# Altium schematic sheet EDU_High-Speed-Design_CPU_SD-Card.SchDoc: CPU SD-Card
size 279 x 215 mm; Date: not used; ApprovedBy: not used; CheckedBy: not used; Author: not used; DrawnBy: not used; Organization: not used; Address4: not used; SheetNumber: 15; SheetTotal: 27; Time: not used; ImagePath: not used; Application_BuildNumber: not used
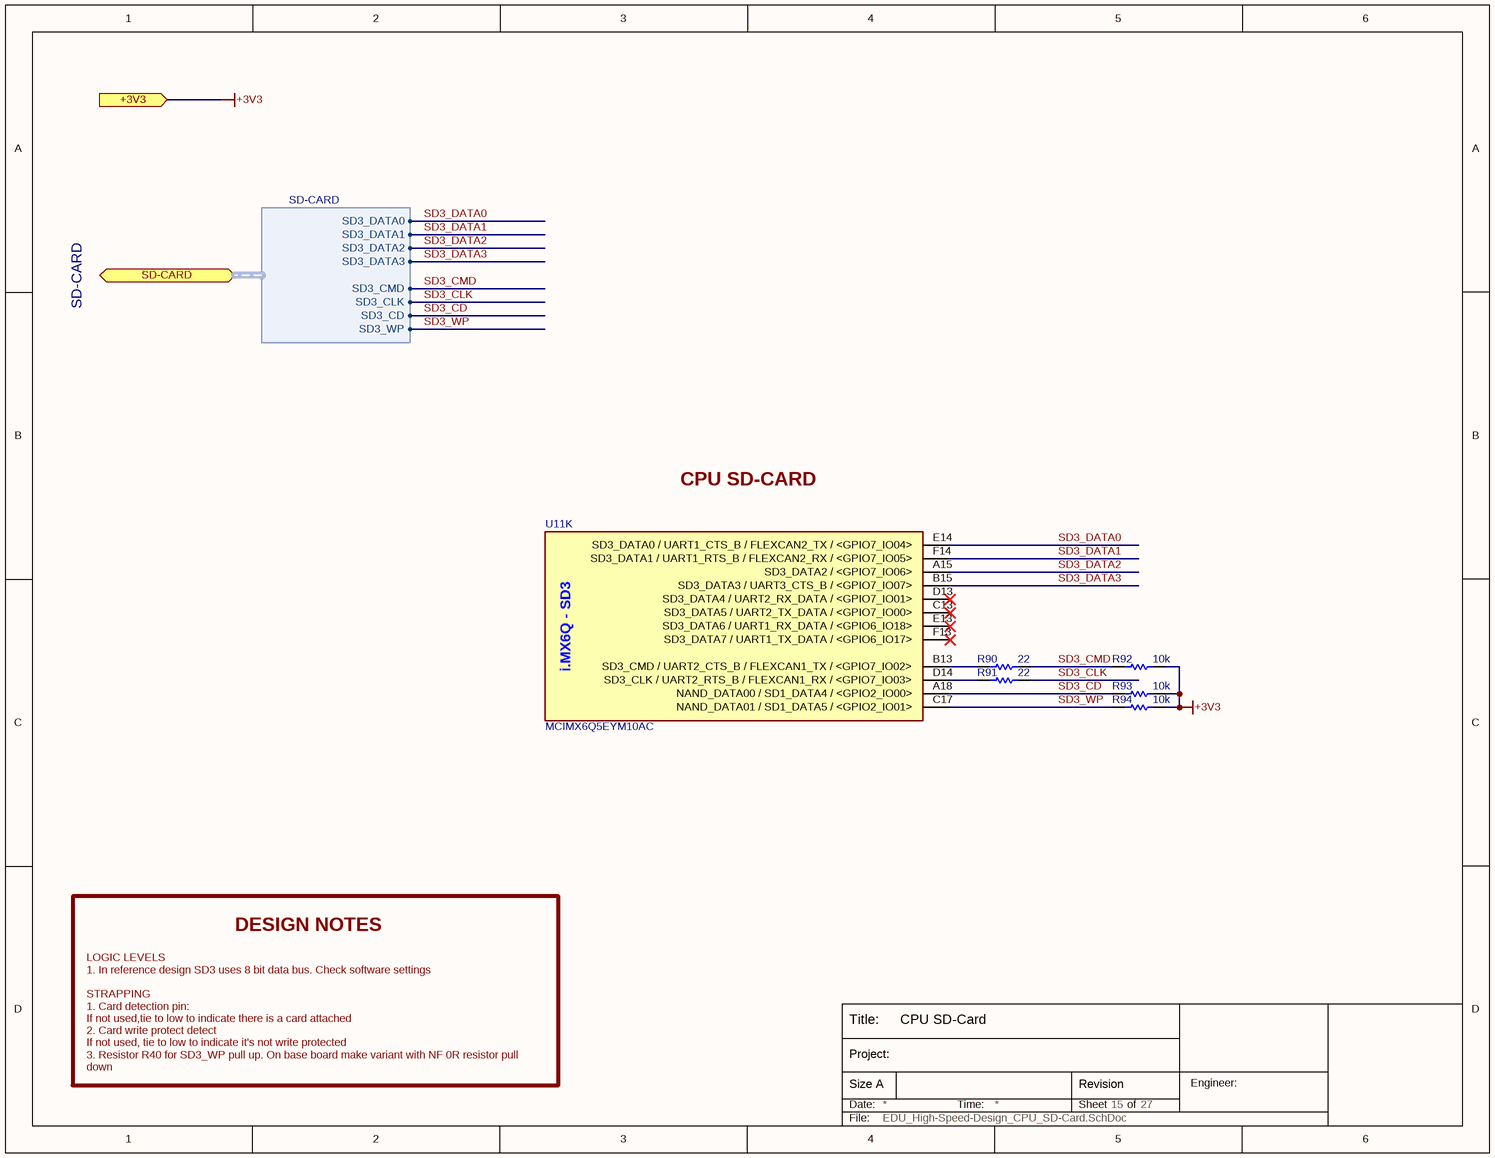
[diagram p0: EDU_High-Speed-Design_CPU_SD-Card.SchDoc]

## Parts
R90  22  [R0402]
R91  22  [R0402]
R92  10k  [R0402]
R93  10k  [R0402]
R94  10k  [R0402]
U11  MCIMX6Q5EYM10AC  [MCIMX6Q5EYM10AC]  (part K of 15)

## Ports
+3V3 (in), SD-CARD (bidir, harness SD-CARD)

## Harnesses
SD-CARD: SD3_DATA0, SD3_DATA3, SD3_DATA2, SD3_CLK, SD3_DATA1, SD3_CD, SD3_WP, SD3_CMD

## Nets
+3V3: R92.2 R93.2 R94.2 ; port +3V3
SD3_CD: R93.1 U11.A18(NAND_DATA00_/_SD1_DATA4_/_<GPIO2_IO00>) ; port SD-CARD.SD3_CD
SD3_CLK: R91.1 ; port SD-CARD.SD3_CLK
SD3_CMD: R90.1 R92.1 ; port SD-CARD.SD3_CMD
SD3_DATA0: U11.E14(SD3_DATA0_/_UART1_CTS_B_/_FLEXCAN2_TX_/_<GPIO7_IO04>) ; port SD-CARD.SD3_DATA0
SD3_DATA1: U11.F14(SD3_DATA1_/_UART1_RTS_B_/_FLEXCAN2_RX_/_<GPIO7_IO05>) ; port SD-CARD.SD3_DATA1
SD3_DATA2: U11.A15(SD3_DATA2_/_<GPIO7_IO06>) ; port SD-CARD.SD3_DATA2
SD3_DATA3: U11.B15(SD3_DATA3_/_UART3_CTS_B_/_<GPIO7_IO07>) ; port SD-CARD.SD3_DATA3
SD3_WP: R94.1 U11.C17(NAND_DATA01_/_SD1_DATA5_/_<GPIO2_IO01>) ; port SD-CARD.SD3_WP
NetR90_2: R90.2 U11.B13(SD3_CMD_/_UART2_CTS_B_/_FLEXCAN1_TX_/_<GPIO7_IO02>)
NetR91_2: R91.2 U11.D14(SD3_CLK_/_UART2_RTS_B_/_FLEXCAN1_RX_/_<GPIO7_IO03>)

Not connected (* = marked no-connect by the designer): U11 C13(SD3_DATA5_/_UART2_TX_DATA_/_<GPIO7_IO00>)* D13(SD3_DATA4_/_UART2_RX_DATA_/_<GPIO7_IO01>)* E13(SD3_DATA6_/_UART1_RX_DATA_/_<GPIO6_IO18>)* F13(SD3_DATA7_/_UART1_TX_DATA_/_<GPIO6_IO17>)*

## Notes on the sheet
- SD-CARD
- CPU SD-CARD
- DESIGN NOTES
- LOGIC LEVELS
  1. In reference design SD3 uses 8 bit data bus. Check software settings
  STRAPPING
  1. Card detection pin:
  If not used,tie to low to indicate there is a card attached
  2. Card write protect detect
  If not used, tie to low to indicate it's not write protected
  3. Resistor R40 for SD3_WP pull up. On base board make variant with NF 0R resistor pull down
- Title:
- Date:
- Size A
- Project:
- Time:
- Sheet
- Revision
- of
- Engineer:
- File:
- (in symbol MCIMX6Q5EYM10AC, part K) i.MX6Q - SD3

## Library data of the parts
R90 R91 = RC0402FR-0722RL: RES 22.0 OHM 1/16W 1% 0402 SMD; Manufacturer 1: Yageo; Manufacturer Part Number 1: RC0402FR-0722RL; Resistance: 22; Supplier 1: Digi-Key; Supplier Part Number 1: 311-22.0LRCT-ND; ComponentLink1URL: http://www.yageo.com/documents/recent/PYu-RC0402_51_RoHS_L_6.pdf; ComponentLink1Description: http://www.yageo.com/documents/recent/PYu-RC0402_51_RoHS_L_6.pdf
R92-R94 = RC0402FR-0710KL: RES 10.0K OHM 1/16W 1% 0402 SMD; Manufacturer 1: Yageo; Manufacturer Part Number 1: RC0402FR-0710KL; Resistance: 10k; Supplier 1: Digi-Key; Supplier Part Number 1: 311-10.0KLRCT-ND; ComponentLink1URL: http://www.yageo.com/documents/recent/PYu-RC0402_51_RoHS_L_6.pdf; ComponentLink1Description: http://www.yageo.com/documents/recent/PYu-RC0402_51_RoHS_L_6.pdf
U11 = MCIMX6Q5EYM10AC: IC MCU 32BIT ARM QUAD 624FCBGA; Manufacturer 1: Freescale Semiconductor; Supplier 1: Digi-Key; Manufacturer Part Number 1: MCIMX6Q5EYM10AC; Supplier Part Number 1: MCIMX6Q5EYM10AC-ND